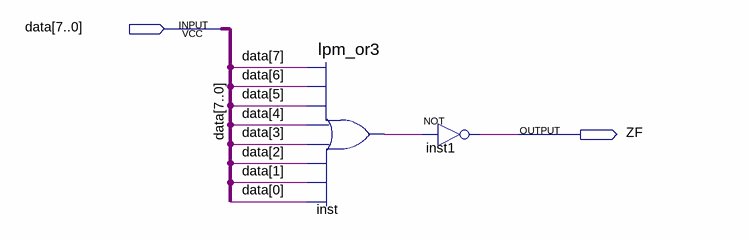
[diagram p0: schematic sheet]
// Quartus schematic ALU_ZF_DEFINER.bdf as structural Verilog: 2 symbols, 2 pins
module ALU_ZF_DEFINER (
  input  [7:0] data,
  output ZF
);

  wire inst_result;

  lpm_or3 inst (
    .data0(data[7]), .data1(data[6]), .data2(data[5]), .data3(data[4]), .data4(data[3]), .data5(data[2]),
    .data6(data[1]), .data7(data[0]), .result(inst_result));
  not inst1 (ZF, inst_result);
endmodule
